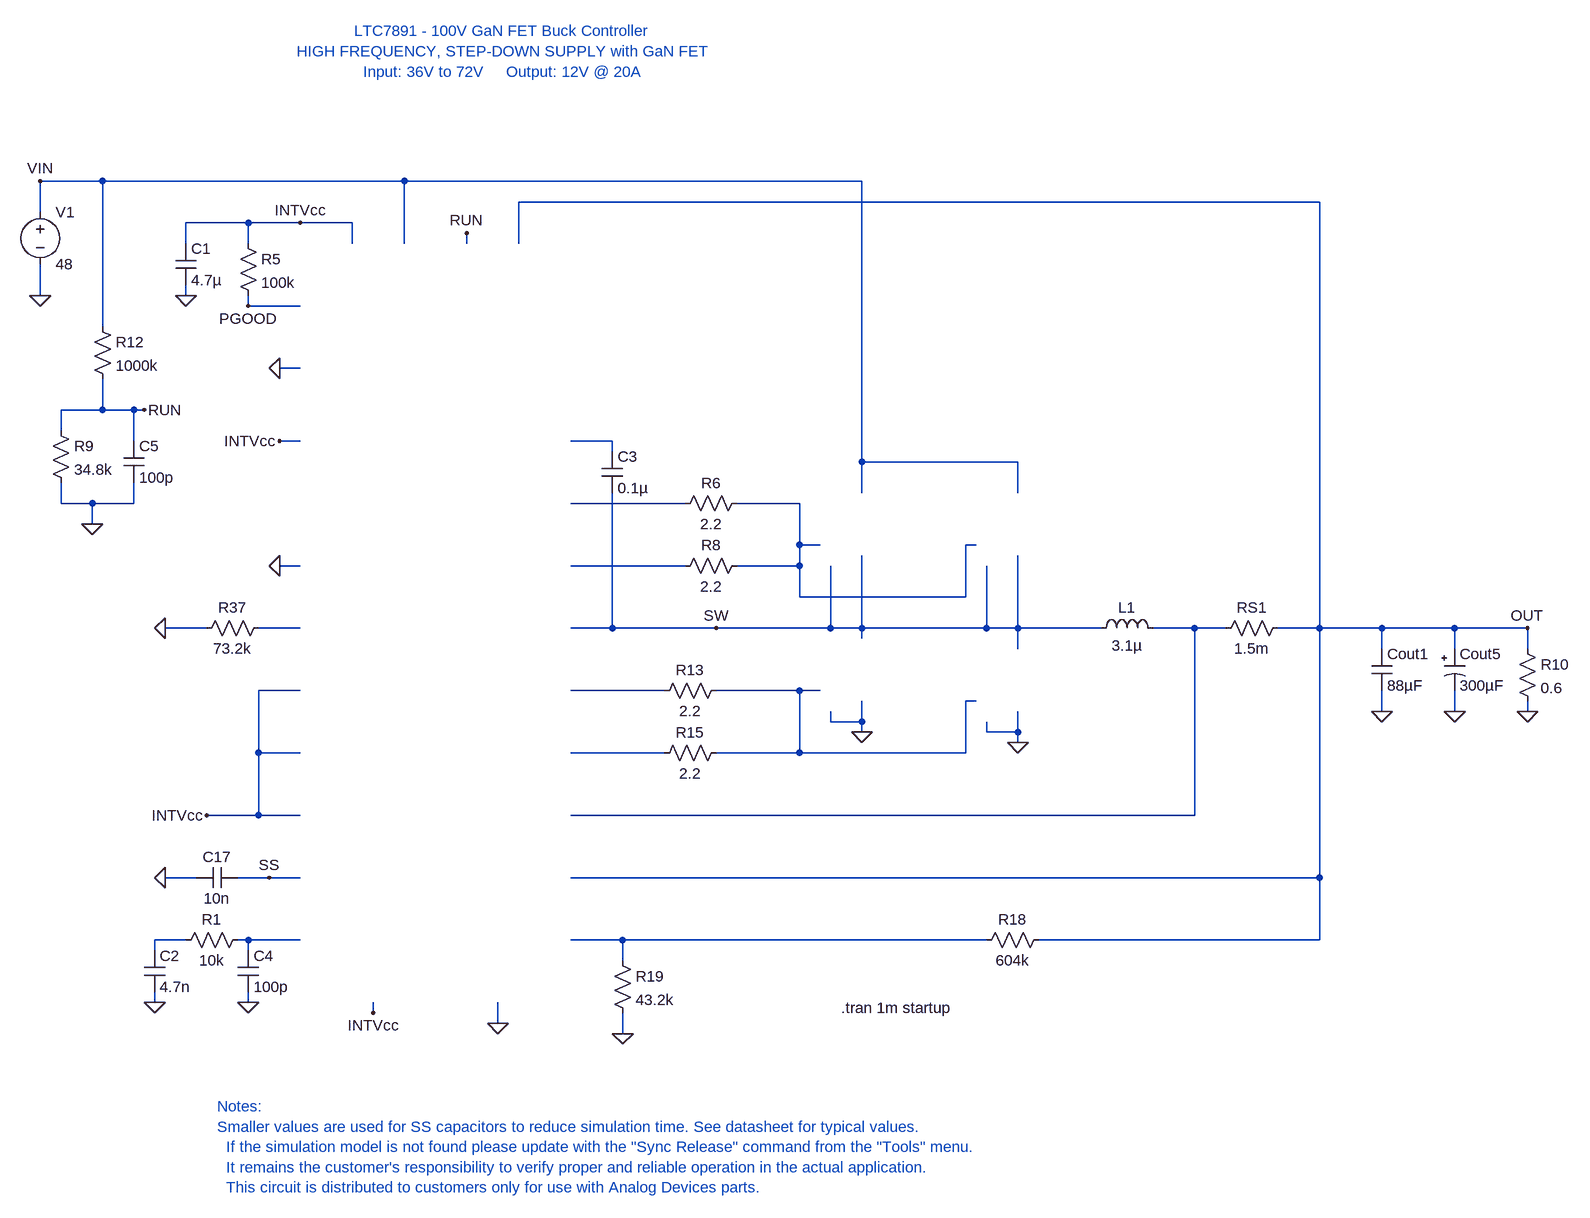
[diagram p0: schematic ltc7891-dc2995a-example-circuit.asc]
ltc7891-dc2995a-example-circuit.asc, the LTspice schematic file:
Version 4
SHEET 1 2648 1256
WIRE -336 -368 -432 -368
WIRE 128 -368 -336 -368
WIRE 832 -368 128 -368
WIRE 1536 -336 304 -336
WIRE -432 -320 -432 -368
WIRE -112 -304 -208 -304
WIRE -32 -304 -112 -304
WIRE 48 -304 -32 -304
WIRE -208 -272 -208 -304
WIRE -112 -272 -112 -304
WIRE 48 -272 48 -304
WIRE 128 -272 128 -368
WIRE 224 -272 224 -288
WIRE 304 -272 304 -336
WIRE -432 -192 -432 -240
WIRE -208 -192 -208 -208
WIRE -112 -176 -112 -192
WIRE -32 -176 -112 -176
WIRE -336 -144 -336 -368
WIRE -32 -80 -64 -80
WIRE -336 -16 -336 -64
WIRE -336 -16 -400 -16
WIRE -288 -16 -336 -16
WIRE -272 -16 -288 -16
WIRE -400 16 -400 -16
WIRE -288 32 -288 -16
WIRE -32 32 -64 32
WIRE 448 32 384 32
WIRE 448 48 448 32
WIRE 832 64 832 -368
WIRE 1072 64 832 64
WIRE 832 112 832 64
WIRE 1072 112 1072 64
WIRE -400 128 -400 96
WIRE -352 128 -400 128
WIRE -288 128 -288 96
WIRE -288 128 -352 128
WIRE 560 128 384 128
WIRE 736 128 640 128
WIRE -352 160 -352 128
WIRE 736 192 736 128
WIRE 768 192 736 192
WIRE 1008 192 992 192
WIRE -32 224 -64 224
WIRE 560 224 384 224
WIRE 736 224 736 192
WIRE 736 224 640 224
WIRE 736 272 736 224
WIRE 992 272 992 192
WIRE 992 272 736 272
WIRE -176 320 -240 320
WIRE -32 320 -96 320
WIRE 448 320 448 112
WIRE 448 320 384 320
WIRE 608 320 448 320
WIRE 784 320 784 224
WIRE 784 320 608 320
WIRE 832 320 832 208
WIRE 832 320 784 320
WIRE 1024 320 1024 224
WIRE 1024 320 832 320
WIRE 1072 320 1072 208
WIRE 1072 320 1024 320
WIRE 1200 320 1072 320
WIRE 1344 320 1280 320
WIRE 1392 320 1344 320
WIRE 1536 320 1536 -336
WIRE 1536 320 1472 320
WIRE 1632 320 1536 320
WIRE 1744 320 1632 320
WIRE 1856 320 1744 320
WIRE 832 336 832 320
WIRE 1072 352 1072 320
WIRE 1632 352 1632 320
WIRE 1744 352 1744 320
WIRE 1856 352 1856 320
WIRE -32 416 -96 416
WIRE 528 416 384 416
WIRE 736 416 608 416
WIRE 768 416 736 416
WIRE 1008 432 992 432
WIRE 1632 448 1632 416
WIRE 1744 448 1744 416
WIRE 1856 448 1856 432
WIRE 784 464 784 448
WIRE 832 464 832 432
WIRE 832 464 784 464
WIRE 832 480 832 464
WIRE 1024 480 1024 464
WIRE 1072 480 1072 448
WIRE 1072 480 1024 480
WIRE 1072 496 1072 480
WIRE -96 512 -96 416
WIRE -32 512 -96 512
WIRE 528 512 384 512
WIRE 736 512 736 416
WIRE 736 512 608 512
WIRE 992 512 992 432
WIRE 992 512 736 512
WIRE -96 608 -96 512
WIRE -96 608 -176 608
WIRE -32 608 -96 608
WIRE 1344 608 1344 320
WIRE 1344 608 384 608
WIRE -192 704 -240 704
WIRE -80 704 -128 704
WIRE -32 704 -80 704
WIRE 1536 704 1536 320
WIRE 1536 704 384 704
WIRE -208 800 -256 800
WIRE -112 800 -128 800
WIRE -32 800 -112 800
WIRE 464 800 384 800
WIRE 1024 800 464 800
WIRE 1536 800 1536 704
WIRE 1536 800 1104 800
WIRE -256 816 -256 800
WIRE -112 816 -112 800
WIRE 464 832 464 800
WIRE -256 896 -256 880
WIRE -112 896 -112 880
WIRE 80 912 80 896
WIRE 272 928 272 896
WIRE 464 944 464 912
FLAG -432 -192 0
FLAG -64 -80 0
FLAG -208 -192 0
FLAG -240 704 0
FLAG 272 928 0
FLAG 832 480 0
FLAG 464 944 0
FLAG 1632 448 0
FLAG 1744 448 0
FLAG -240 320 0
FLAG -64 224 0
FLAG 1856 448 0
FLAG -32 -304 INTVcc
FLAG -176 608 INTVcc
FLAG 1856 320 OUT
FLAG -64 32 INTVcc
FLAG 80 912 INTVcc
FLAG 608 320 SW
FLAG -432 -368 VIN
FLAG -352 160 0
FLAG 1072 496 0
FLAG -80 704 SS
FLAG -272 -16 RUN
FLAG 224 -288 RUN
FLAG -112 -176 PGOOD
FLAG -256 896 0
FLAG -112 896 0
SYMBOL voltage -432 -336 R0
WINDOW 123 0 0 Left 0
WINDOW 39 0 0 Left 0
SYMATTR InstName V1
SYMATTR Value 48
SYMBOL cap -224 -272 R0
SYMATTR InstName C1
SYMATTR Value 4.7µ
SYMATTR SpiceLine Rser=5m
SYMBOL cap -128 720 M270
WINDOW 0 32 32 VTop 2
WINDOW 3 0 32 VBottom 2
SYMATTR InstName C17
SYMATTR Value 10n
SYMBOL cap 432 48 R0
SYMATTR InstName C3
SYMATTR Value 0.1µ
SYMBOL ind 1184 336 R270
WINDOW 0 32 56 VTop 2
WINDOW 3 5 56 VBottom 2
SYMATTR InstName L1
SYMATTR Value 3.1µ
SYMATTR SpiceLine Rser=0.0023 Cpar=0
SYMBOL res 656 112 R90
WINDOW 0 0 56 VBottom 2
WINDOW 3 32 56 VTop 2
SYMATTR InstName R6
SYMATTR Value 2.2
SYMBOL res 656 208 R90
WINDOW 0 0 56 VBottom 2
WINDOW 3 32 56 VTop 2
SYMATTR InstName R8
SYMATTR Value 2.2
SYMBOL res 624 400 R90
WINDOW 0 0 56 VBottom 2
WINDOW 3 32 56 VTop 2
SYMATTR InstName R13
SYMATTR Value 2.2
SYMBOL res 624 496 R90
WINDOW 0 0 56 VBottom 2
WINDOW 3 32 56 VTop 2
SYMATTR InstName R15
SYMATTR Value 2.2
SYMBOL res 1376 336 R270
WINDOW 0 32 56 VTop 2
WINDOW 3 0 56 VBottom 2
SYMATTR InstName RS1
SYMATTR Value 1.5m
SYMBOL res 1120 784 R90
WINDOW 0 0 56 VBottom 2
WINDOW 3 32 56 VTop 2
SYMATTR InstName R18
SYMATTR Value 604k
SYMBOL res 448 816 R0
SYMATTR InstName R19
SYMATTR Value 43.2k
SYMBOL polcap 1728 352 R0
WINDOW 3 24 56 Left 2
SYMATTR Value 300µF
SYMATTR InstName Cout5
SYMATTR Description Capacitor
SYMATTR Type cap
SYMATTR SpiceLine Rser=0.017
SYMBOL res -80 304 R90
WINDOW 0 0 56 VBottom 2
WINDOW 3 32 56 VTop 2
SYMATTR InstName R37
SYMATTR Value 73.2k
SYMBOL res 1840 336 R0
SYMATTR InstName R10
SYMATTR Value 0.6
SYMBOL res -128 -288 R0
SYMATTR InstName R5
SYMATTR Value 100k
SYMBOL res -416 0 R0
SYMATTR InstName R9
SYMATTR Value 34.8k
SYMBOL res -352 -160 R0
SYMATTR InstName R12
SYMATTR Value 1000k
SYMBOL cap -304 32 R0
SYMATTR InstName C5
SYMATTR Value 100p
SYMBOL cap 1616 352 R0
SYMATTR InstName Cout1
SYMATTR Value 88µF
SYMBOL cap -272 816 R0
SYMATTR InstName C2
SYMATTR Value 4.7n
SYMBOL res -112 784 R90
WINDOW 0 0 56 VBottom 2
WINDOW 3 32 56 VTop 2
SYMATTR InstName R1
SYMATTR Value 10k
SYMBOL cap -128 816 R0
SYMATTR InstName C4
SYMATTR Value 100p
TEXT 800 904 Left 2 !.tran 1m startup
TEXT 280 -568 Center 2 ;LTC7891 - 100V GaN FET Buck Controller\nHIGH FREQUENCY, STEP-DOWN SUPPLY with GaN FET\nInput: 36V to 72V     Output: 12V @ 20A
TEXT -160 1056 Left 2 ;Notes:  \nSmaller values are used for SS capacitors to reduce simulation time. See datasheet for typical values.\n  If the simulation model is not found please update with the "Sync Release" command from the "Tools" menu.\n  It remains the customer's responsibility to verify proper and reliable operation in the actual application.\n  This circuit is distributed to customers only for use with Analog Devices parts.

The netlist it stands for:
* ltc7891-dc2995a-example-circuit.asc
V1 VIN 0 48
C1 INTVcc 0 4.7µ Rser=5m
C17 SS 0 10n
C3 N001 SW 0.1µ
L1 SW N006 3.1µ Rser=0.0023 Cpar=0
R6 N003 N002 2.2
R8 N003 N004 2.2
R13 N008 N007 2.2
R15 N008 N009 2.2
RS1 N006 OUT 1.5m
R18 OUT N012 604k
R19 N012 0 43.2k
Cout5 OUT 0 300µF Rser=0.017
R37 N005 0 73.2k
R10 OUT 0 0.6
R5 INTVcc PGOOD 100k
R9 RUN 0 34.8k
R12 VIN RUN 1000k
C5 RUN 0 100p
Cout1 OUT 0 88µF
C2 N010 0 4.7n
R1 N011 N010 10k
C4 N011 0 100p
.tran 1m startup
* LTC7891 - 100V GaN FET Buck Controller
* HIGH FREQUENCY, STEP-DOWN SUPPLY with GaN FET
* Input: 36V to 72V     Output: 12V @ 20A
* Notes:
* Smaller values are used for SS capacitors to reduce simulation time. See datasheet for typical values.
*   If the simulation model is not found please update with the "Sync Release" command from the "Tools" menu.
*   It remains the customer's responsibility to verify proper and reliable operation in the actual application.
*   This circuit is distributed to customers only for use with Analog Devices parts.
.backanno
.end